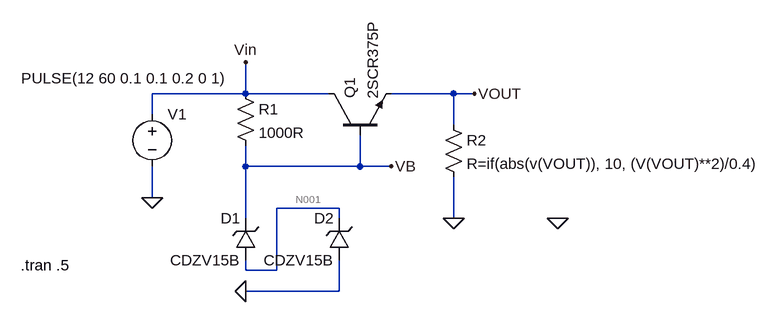
[diagram p0: schematic VoltageClamp.asc]
VoltageClamp.asc, the LTspice schematic file:
Version 4
SHEET 1 1000 680
WIRE 208 0 208 -48
WIRE 208 0 64 0
WIRE 336 0 208 0
WIRE 528 0 432 0
WIRE 560 0 528 0
WIRE 64 32 64 0
WIRE 528 48 528 0
WIRE 208 112 208 80
WIRE 384 112 384 64
WIRE 384 112 208 112
WIRE 432 112 384 112
WIRE 64 160 64 112
WIRE 352 176 256 176
WIRE 208 192 208 112
WIRE 352 192 352 176
WIRE 528 192 528 128
WIRE 208 272 208 256
WIRE 256 272 256 176
WIRE 256 272 208 272
WIRE 352 304 352 256
WIRE 352 304 208 304
FLAG 208 304 0
FLAG 528 192 0
FLAG 64 160 0
FLAG 560 0 VOUT
FLAG 432 112 VB
FLAG 208 -48 Vin
FLAG 688 192 0
SYMBOL zener 224 256 R180
WINDOW 0 24 64 Left 2
WINDOW 3 24 0 Left 2
SYMATTR InstName D1
SYMATTR Value CDZV15B
SYMBOL res 192 -16 R0
SYMATTR InstName R1
SYMATTR Value 1000R
SYMBOL npn 336 64 R270
SYMATTR InstName Q1
SYMATTR Value 2SCR375P
SYMBOL res 512 32 R0
SYMATTR InstName R2
SYMATTR Value R=if(abs(v(VOUT)), 10, (V(VOUT)**2)/0.4)
SYMBOL voltage 64 16 R0
WINDOW 3 -201 -40 Left 2
WINDOW 123 0 0 Left 0
WINDOW 39 0 0 Left 0
SYMATTR InstName V1
SYMATTR Value PULSE(12 60 0.1 0.1 0.2 0 1)
SYMBOL zener 368 256 R180
WINDOW 0 24 64 Left 2
WINDOW 3 24 0 Left 2
SYMATTR InstName D2
SYMATTR Value CDZV15B
TEXT -138 264 Left 2 !.tran .5

The netlist it stands for:
* VoltageClamp.asc
D1 N001 VB CDZV15B
R1 Vin VB 1000R
Q1 Vin VB VOUT 0 2SCR375P
R2 VOUT 0 R=if(abs(v(VOUT)), 10, (V(VOUT)**2)/0.4)
V1 Vin 0 PULSE(12 60 0.1 0.1 0.2 0 1)
D2 0 N001 CDZV15B
.model D D
.lib standard.dio
.model NPN NPN
.model PNP PNP
.lib standard.bjt
.tran .5
.backanno
.end

* Results of the author's LTspice run, read from the files saved beside the schematic
* Operating Point, zero values left out:
*   V(n001) = 435.7 mV
*   V(vb) = 871.5 mV
*   V(vin) = 12 V
*   V(vout) = 37.87 nV
*   I(R2) = 10.56 MA
*   Ic(Q1) = 2.612 A
*   Ib(Q1) = 11.13 mA
*   Ie(Q1) = -2.623 A
*   I(D2) = -1.191 pA
*   I(D1) = -1.192 pA
*   I(R1) = 11.13 mA
*   I(V1) = -2.623 A
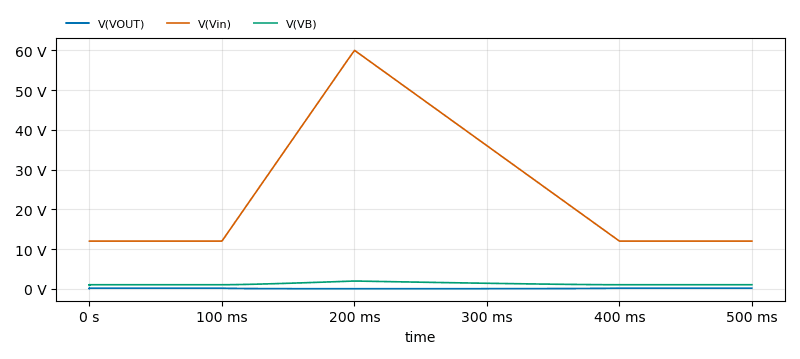
[diagram p1: Transient Analysis of VoltageClamp.asc, plotted from the saved traces]
* Transient Analysis, 1 run:
*   V(VOUT): min 37.87 nV, max 156.7 mV, average 90.72 mV, rms 107.9 mV, last 155.2 mV
*   V(Vin): min 12 V, max 59.98 V, average 26.4 V, rms 30.88 V, last 12 V
*   V(VB): min 871.5 mV, max 1.958 V, average 1.261 V, rms 1.296 V, last 1.024 V